# Altium schematic sheet Main.SchDoc
size A4
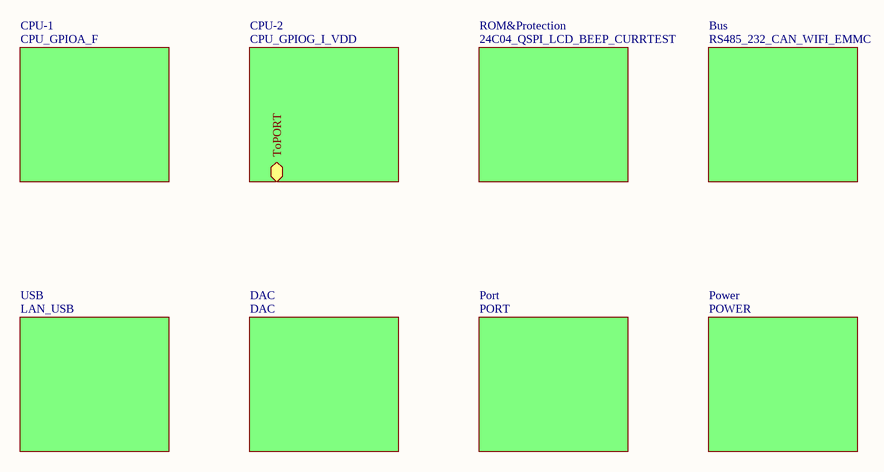
[diagram p0: Main.SchDoc]

## Sub-sheets
Bus = RS485_232_CAN_WIFI_EMMC: no entries
CPU-1 = CPU_GPIOA_F: no entries
CPU-2 = CPU_GPIOG_I_VDD: ToPORT
DAC = DAC: no entries
Port = PORT: no entries
Power = POWER: no entries
ROM&Protection = 24C04_QSPI_LCD_BEEP_CURRTEST: no entries
USB = LAN_USB: no entries

## Notes on the sheet
- UniverGao
- /